# Altium schematic sheet cpu.SchDoc: CENTRAL PROCESSING UNIT
size A3; DocumentNumber: UNCNC.04.00.001
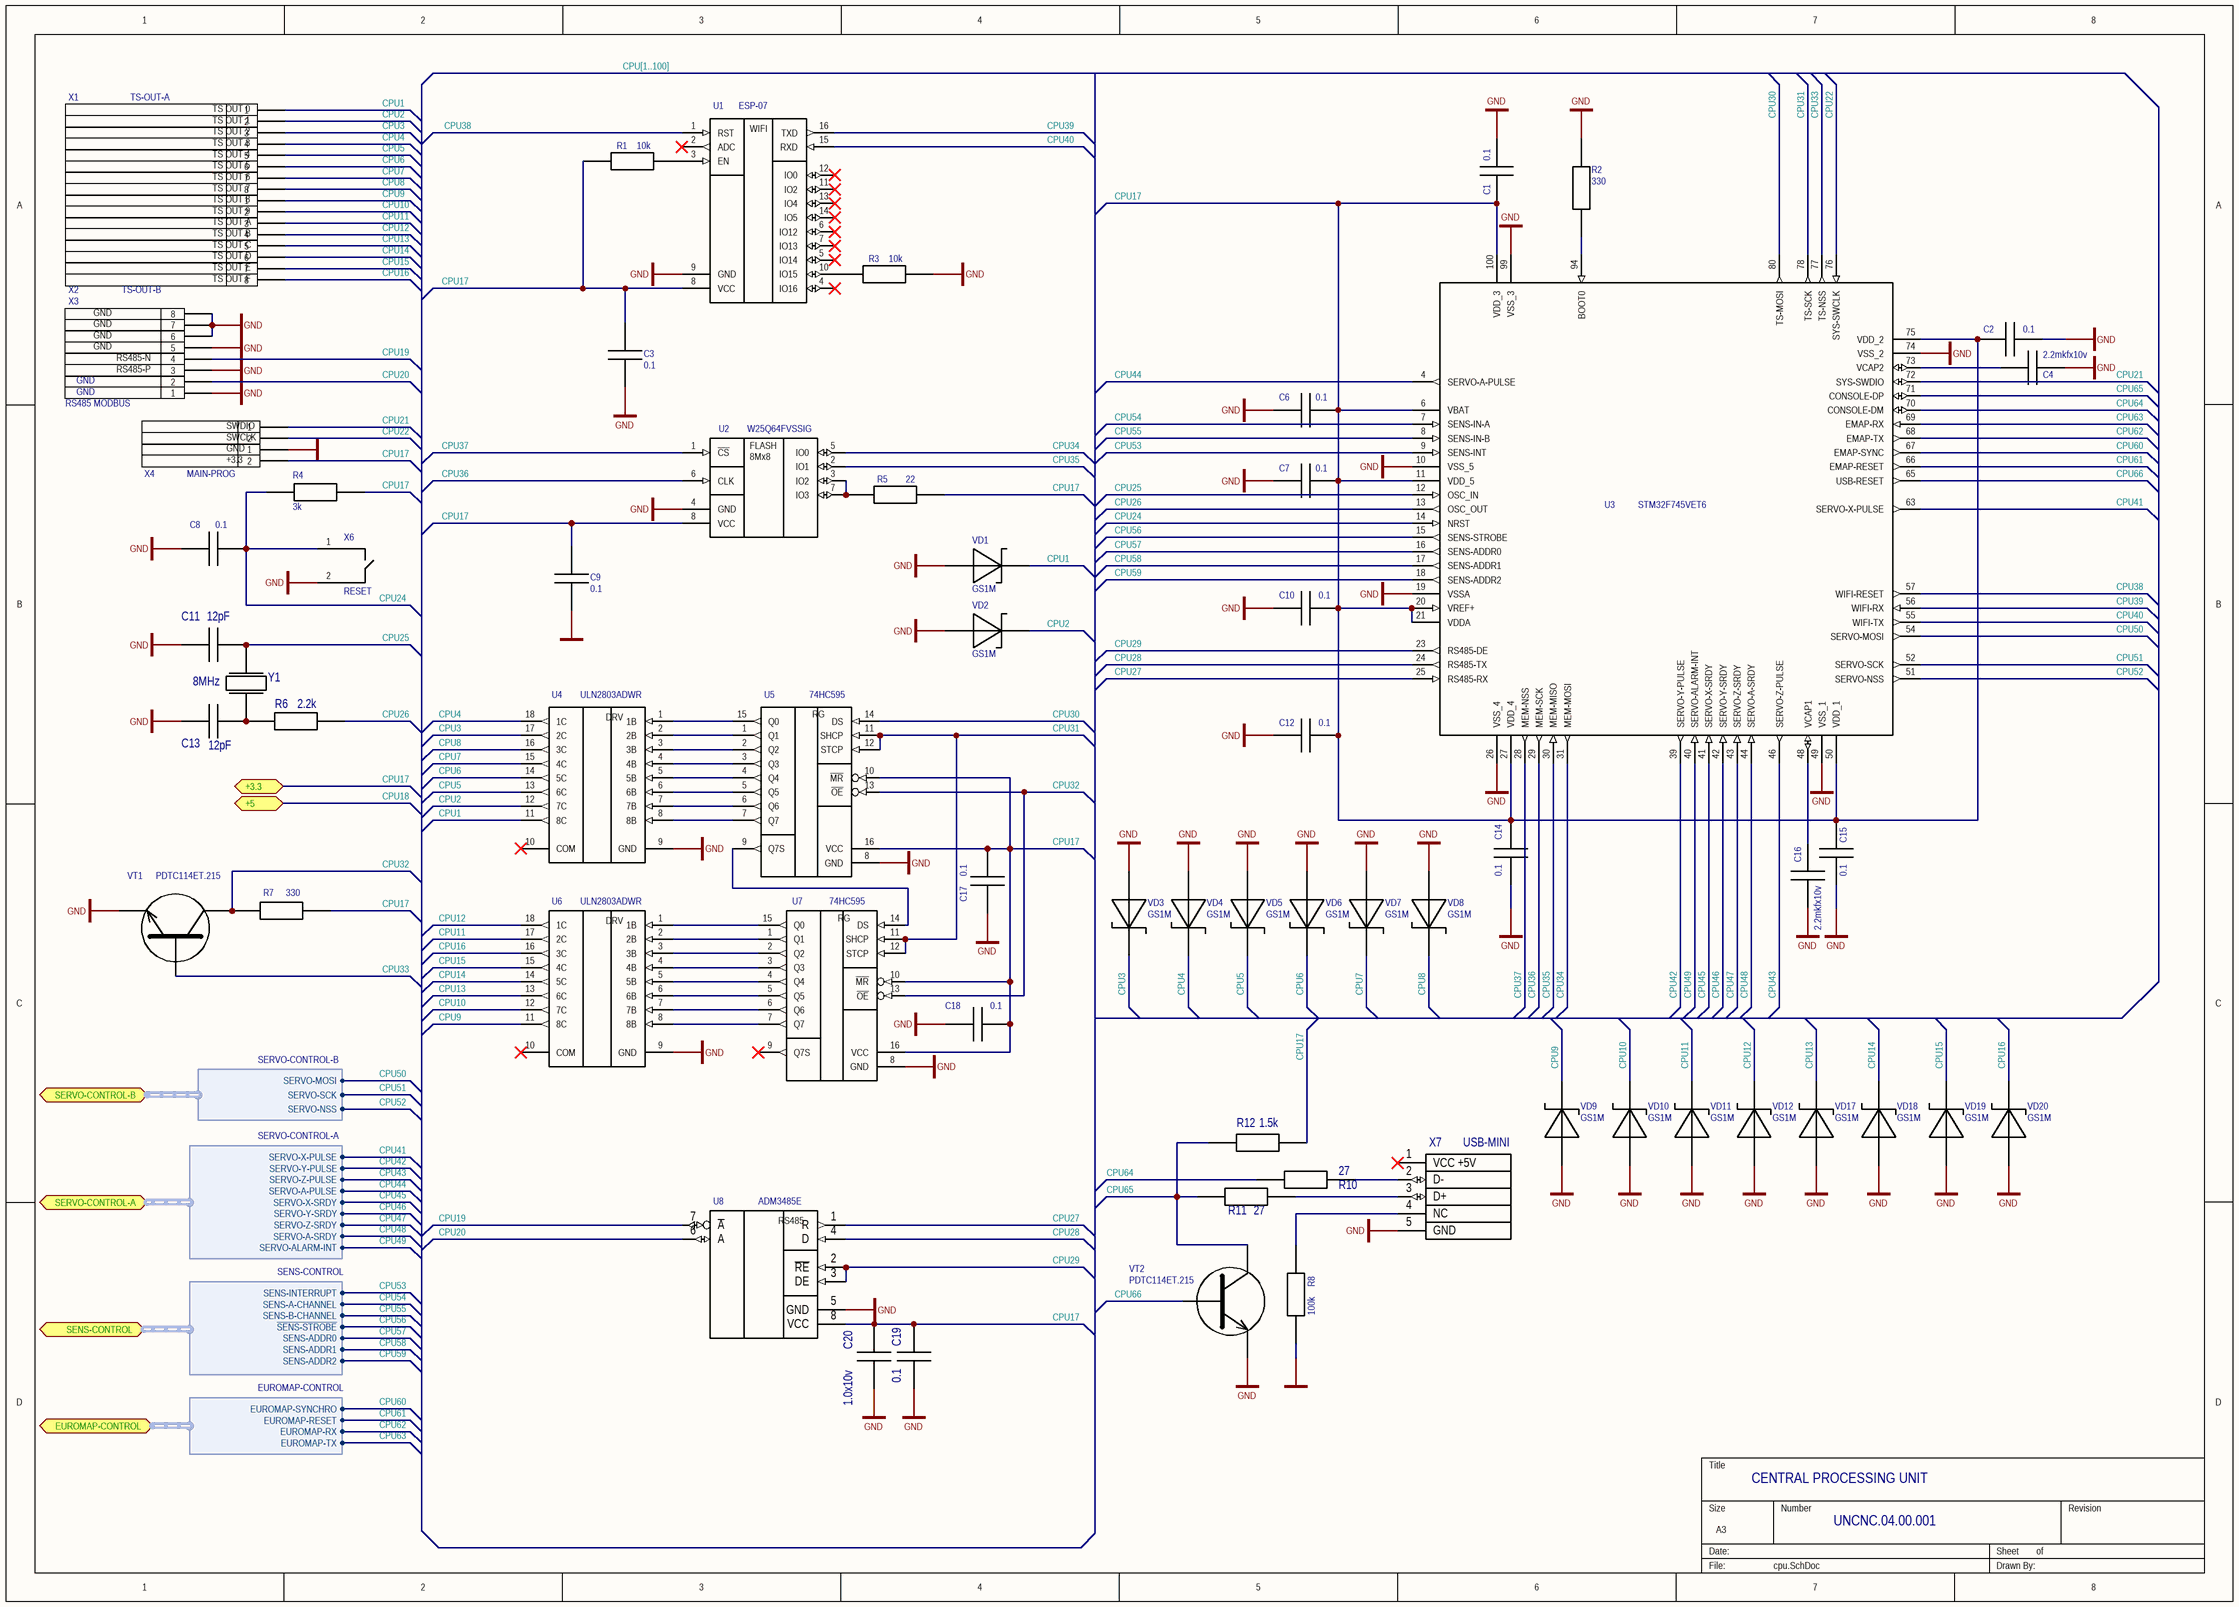
[diagram p0: cpu.SchDoc]

## Parts
C1  0.1  [CAPC1608X05N]
C2  0.1  [CAPC1608X05N]
C3  0.1  [CAPC2012X04N]
C4  2.2mkfx10v  [CAPC1608X05N]
C6  0.1  [CAPC1608X05N]
C7  0.1  [CAPC1608X05N]
C8  0.1  [CAPC1608X05N]
C9  0.1  [CAPC2012X04N]
C10  0.1  [CAPC1608X05N]
C11  12pF  [CAPC1608X05N]
C12  0.1  [CAPC1608X05N]
C13  12pF  [CAPC1608X05N]
C14  0.1  [CAPC1608X05N]
C15  0.1  [CAPC1608X05N]
C16  2.2mkfx10v  [CAPC1608X05N]
C17  0.1  [CAPC2012X04N]
C18  0.1  [CAPC2012X04N]
C19  0.1  [CAPC2012X04N]
C20  1.0x10v  [CAPC2012X04N]
R1  10k  [RESC2012X04N]
R2  330  [RESC1608X05N]
R3  10k  [RESC2012X04N]
R4  3k  [RESC1608X05N]
R5  22  [RESC2012X04N]
R6  2.2k  [RESC1608X05N]
R7  330  [RESC1608X05N]
R8  100k  [RESC2012X04N]
R10  27  [RESC2012X04N]
R11  27  [RESC2012X04N]
R12  1.5k  [RESC2012X04N]
U1  ESP-07  [ESP-07]
U2  W25Q64FVSSIG  [SOIC127P790X203-8N(WIDE)]
U3  STM32F745VET6  [TSQFP50P1600X1600X160-100N]
U4  ULN2803ADWR  [SOIC127P1030X265-18N]
U5  74HC595  [SOP127P700X210-16N]
U6  ULN2803ADWR  [SOIC127P1030X265-18N]
U7  74HC595  [SOP127P700X210-16N]
U8  ADM3485E  [SOIC127P600X175-8N]
VD1  GS1M  [DIOM4336X21N]
VD2  GS1M  [DIOM4336X21N]
VD3  GS1M  [DIOM4336X21N]
VD4  GS1M  [DIOM4336X21N]
VD5  GS1M  [DIOM4336X21N]
VD6  GS1M  [DIOM4336X21N]
VD7  GS1M  [DIOM4336X21N]
VD8  GS1M  [DIOM4336X21N]
VD9  GS1M  [DIOM4336X21N]
VD10  GS1M  [DIOM4336X21N]
VD11  GS1M  [DIOM4336X21N]
VD12  GS1M  [DIOM4336X21N]
VD17  GS1M  [DIOM4336X21N]
VD18  GS1M  [DIOM4336X21N]
VD19  GS1M  [DIOM4336X21N]
VD20  GS1M  [DIOM4336X21N]
VT1  PDTC114ET.215  [SOT95P238X102-3N]
VT2  PDTC114ET.215  [SOT95P238X102-3N]
X1  TS-OUT-A  [MINI-FIT-8-WAY-SM]
X2  TS-OUT-B  [MINI-FIT-8-WAY-SM]
X3  RS485 MODBUS  [RJ45-CAN]
X4  MAIN-PROG  [ZL201-2]
X5  Jamper ZL201  [ZL201-2]  (value not drawn)
X6  RESET  [TACT SWITCH]
X7  USB-MINI  [229-5FB-MINI-USB]
Y1  8MHz  [KX-13]

## Ports
+3.3, +5, EUROMAP-CONTROL (harness EUROMAP-CONTROL), SENS-CONTROL (harness SENS-CONTROL), SERVO-CONTROL-A (harness SERVO-CONTROL-A), SERVO-CONTROL-B (harness SERVO-CONTROL-B)

## Harnesses
SERVO-CONTROL-B: SERVO-MOSI, SERVO-SCK, SERVO-NSS
SERVO-CONTROL-A: SERVO-X-PULSE, SERVO-Y-PULSE, SERVO-Z-PULSE, SERVO-A-PULSE, SERVO-X-SRDY, SERVO-Y-SRDY, SERVO-Z-SRDY, SERVO-A-SRDY, SERVO-ALARM-INT
SENS-CONTROL: SENS-INTERRUPT, SENS-A-CHANNEL, SENS-B-CHANNEL, ~{SENS-STROBE}, SENS-ADDR0, SENS-ADDR1, SENS-ADDR2
EUROMAP-CONTROL: EUROMAP-SYNCHRO, EUROMAP-RESET, EUROMAP-RX, EUROMAP-TX

## Nets
GND: C1.2 C2.1 C3.1 C4.1 C6.2 C7.2 C8.2 C9.1 C10.2 C11.1 C12.2 C13.1 C14.1 C15.1 C16.1 C17.1 C18.1 C19.1 C20.1 R2.2 R3.2 R8.1 U1.9(GND) U2.4(GND) U3.10(VSS_5) U3.19(VSSA) U3.26(VSS_4) U3.49(VSS_1) U3.74(VSS_2) U3.99(VSS_3) U4.9(GND) U5.8(GND) U6.9(GND) U7.8(GND) U8.5(GND) VD1.2(A) VD2.2(A) VD3.2(A) VD4.2(A) VD5.2(A) VD6.2(A) VD7.2(A) VD8.2(A) VD9.2(A) VD10.2(A) VD11.2(A) VD12.2(A) VD17.2(A) VD18.2(A) VD19.2(A) VD20.2(A) VT1.2(E) VT2.2(E) X3.1 X3.3 X3.5 X3.6 X3.7 X3.8 X5.1 X6.2 X7.5(GND)
CPU1: U4.11(8C) VD1.1(C) X1.1
CPU2: U4.12(7C) VD2.1(C) X1.2
CPU3: U4.17(2C) VD3.1(C) X1.3
CPU4: U4.18(1C) VD4.1(C) X1.4
CPU5: U4.13(6C) VD5.1(C) X1.5
CPU6: U4.14(5C) VD6.1(C) X1.6
CPU7: U4.15(4C) VD7.1(C) X1.7
CPU8: U4.16(3C) VD8.1(C) X1.8
CPU9: U6.11(8C) VD9.1(C) X2.1
CPU10: U6.12(7C) VD10.1(C) X2.2
CPU11: U6.17(2C) VD11.1(C) X2.3
CPU12: U6.18(1C) VD12.1(C) X2.4
CPU13: U6.13(6C) VD17.1(C) X2.5
CPU14: U6.14(5C) VD18.1(C) X2.6
CPU15: U6.15(4C) VD19.1(C) X2.7
CPU16: U6.16(3C) VD20.1(C) X2.8
CPU17: C1.1 C2.2 C3.2 C6.1 C7.1 C9.2 C10.1 C12.1 C14.2 C15.2 C17.2 C18.2 C19.2 C20.2 R1.1 R4.1 R5.2 R7.1 R12.2 U1.8(VCC) U2.8(VCC) U3.6(VBAT) U3.11(VDD_5) U3.20(VREF+) U3.21(VDDA) U3.27(VDD_4) U3.50(VDD_1) U3.75(VDD_2) U3.100(VDD_3) U5.10(~{MR}) U5.16(VCC) U7.10(~{MR}) U7.16(VCC) U8.8(VCC) X5.2 ; port +3.3
CPU18: port +5
CPU19: U8.7(~{A}) X3.4
CPU20: U8.6(A) X3.2
CPU21: U3.72(SYS-SWDIO) X4.1
CPU22: U3.76(SYS-SWCLK) X4.2
CPU24: C8.1 R4.2 U3.14(NRST) X6.1
CPU25: C11.2 U3.12(OSC_IN) Y1.2
CPU26: R6.2 U3.13(OSC_OUT)
CPU27: U3.25(RS485-RX) U8.1(R)
CPU28: U3.24(RS485-TX) U8.4(D)
CPU29: U3.23(RS485-DE) U8.2(~{RE}) U8.3(DE)
CPU30: U3.80(TS-MOSI) U5.14(DS)
CPU31: U3.78(TS-SCK) U5.11(SHCP) U5.12(STCP) U7.11(SHCP) U7.12(STCP)
CPU32: R7.2 U5.13(~{OE}) U7.13(~{OE}) VT1.3(C)
CPU33: U3.77(TS-NSS) VT1.1(B)
CPU34: U2.5(IO0) U3.31(MEM-MOSI)
CPU35: U2.2(IO1) U3.30(MEM-MISO)
CPU36: U2.6(CLK) U3.29(MEM-SCK)
CPU37: U2.1(~{CS}) U3.28(MEM-NSS)
CPU38: U1.1(RST) U3.57(WIFI-RESET)
CPU39: U1.16(TXD) U3.56(WIFI-RX)
CPU40: U1.15(RXD) U3.55(WIFI-TX)
CPU41: U3.63(SERVO-X-PULSE) ; port SERVO-CONTROL-A.SERVO-X-PULSE
CPU42: U3.39(SERVO-Y-PULSE) ; port SERVO-CONTROL-A.SERVO-Y-PULSE
CPU43: U3.46(SERVO-Z-PULSE) ; port SERVO-CONTROL-A.SERVO-Z-PULSE
CPU44: U3.4(SERVO-A-PULSE) ; port SERVO-CONTROL-A.SERVO-A-PULSE
CPU45: U3.41(SERVO-X-SRDY) ; port SERVO-CONTROL-A.SERVO-X-SRDY
CPU46: U3.42(SERVO-Y-SRDY) ; port SERVO-CONTROL-A.SERVO-Y-SRDY
CPU47: U3.43(SERVO-Z-SRDY) ; port SERVO-CONTROL-A.SERVO-Z-SRDY
CPU48: U3.44(SERVO-A-SRDY) ; port SERVO-CONTROL-A.SERVO-A-SRDY
CPU49: U3.40(SERVO-ALARM-INT) ; port SERVO-CONTROL-A.SERVO-ALARM-INT
CPU50: U3.54(SERVO-MOSI) ; port SERVO-CONTROL-B.SERVO-MOSI
CPU51: U3.52(SERVO-SCK) ; port SERVO-CONTROL-B.SERVO-SCK
CPU52: U3.51(SERVO-NSS) ; port SERVO-CONTROL-B.SERVO-NSS
CPU53: U3.9(SENS-INT) ; port SENS-CONTROL.SENS-INTERRUPT
CPU54: U3.7(SENS-IN-A) ; port SENS-CONTROL.SENS-A-CHANNEL
CPU55: U3.8(SENS-IN-B) ; port SENS-CONTROL.SENS-B-CHANNEL
CPU56: U3.15(SENS-STROBE) ; port SENS-CONTROL.~{SENS-STROBE}
CPU57: U3.16(SENS-ADDR0) ; port SENS-CONTROL.SENS-ADDR0
CPU58: U3.17(SENS-ADDR1) ; port SENS-CONTROL.SENS-ADDR1
CPU59: U3.18(SENS-ADDR2) ; port SENS-CONTROL.SENS-ADDR2
CPU60: U3.67(EMAP-SYNC) ; port EUROMAP-CONTROL.EUROMAP-SYNCHRO
CPU61: U3.66(EMAP-RESET) ; port EUROMAP-CONTROL.EUROMAP-RESET
CPU62: U3.68(EMAP-TX) ; port EUROMAP-CONTROL.EUROMAP-RX
CPU63: U3.69(EMAP-RX) ; port EUROMAP-CONTROL.EUROMAP-TX
CPU64: R10.1 U3.70(CONSOLE-DM)
CPU65: R11.1 R12.1 U3.71(CONSOLE-DP) VT2.3(C)
CPU66: U3.65(USB-RESET) VT2.1(B)
NetC4_2: C4.2 U3.73(VCAP2)
NetC13_2: C13.2 R6.1 Y1.1
NetC16_2: C16.2 U3.48(VCAP1)
NetR1_2: R1.2 U1.3(EN)
NetR2_1: R2.1 U3.94(BOOT0)
NetR3_1: R3.1 U1.10(IO15)
NetR5_1: R5.1 U2.3(IO2) U2.7(IO3)
NetR8_2: R8.2 X7.4(NC)
NetR10_2: R10.2 X7.2(D-)
NetR11_2: R11.2 X7.3(D+)
NetU4_1: U4.1(1B) U5.15(Q0)
NetU4_2: U4.2(2B) U5.1(Q1)
NetU4_3: U4.3(3B) U5.2(Q2)
NetU4_4: U4.4(4B) U5.3(Q3)
NetU4_5: U4.5(5B) U5.4(Q4)
NetU4_6: U4.6(6B) U5.5(Q5)
NetU4_7: U4.7(7B) U5.6(Q6)
NetU4_8: U4.8(8B) U5.7(Q7)
NetU5_9: U5.9(Q7S) U7.14(DS)
NetU6_1: U6.1(1B) U7.15(Q0)
NetU6_2: U6.2(2B) U7.1(Q1)
NetU6_3: U6.3(3B) U7.2(Q2)
NetU6_4: U6.4(4B) U7.3(Q3)
NetU6_5: U6.5(5B) U7.4(Q4)
NetU6_6: U6.6(6B) U7.5(Q5)
NetU6_7: U6.7(7B) U7.6(Q6)
NetU6_8: U6.8(8B) U7.7(Q7)

Not connected (* = marked no-connect by the designer): U1 2(ADC)* 4(IO16)* 5(IO14)* 6(IO12)* 7(IO13)* 11(IO2)* 12(IO0)* 13(IO4)* 14(IO5)*; U3 1(PE2) 2(PE3) 3(PE4) 5(PE6) 22(PA0-WKUP) 32(PC4) 33(PC5) 34(PB0) 35(PB1) 36(PB2) 37(PE7) 38(PE8) 45(PE15) 47(PB11) 53(PB14) 58(PD11) 59(PD12) 60(PD13) 61(PD14) 62(PD15) 64(PC7) 79(PC11) 81(PD0) 82(PD1) 83(PD2) 84(PD3) 85(PD4) 86(PD5) 87(PD6) 88(PD7) 89(PB3) 90(PB4) 91(PB5) 92(PB6) 93(PB7) 95(PB8) 96(PB9) 97(PE0) 98(PE1); U4 10(COM)*; U6 10(COM)*; U7 9(Q7S)*; X7 1(VCC_+5V)*

## Buses and harness runs
bus CPU[1..100]

## Notes on the sheet
- (near X1) TS OUT 0
- (near X1) TS OUT 1
- (near X1) TS OUT 2
- TS OUT 3
- TS OUT 4
- TS OUT 5
- TS OUT 6
- TS OUT 7
- TS OUT 8
- TS OUT 9
- TS OUT A
- TS OUT B
- TS OUT C
- TS OUT D
- GND
- TS OUT E
- TS OUT F
- RS485-N
- RS485-P
- SWDIO
- SWCLK
- +3.3
- (in symbol 74HC595) RG
- (in symbol ESP-07 Wi-Fi module) WIFI
- (in symbol SN65176BD) RS485
- (in symbol ULN2803ADWR) DRV
- (in symbol W25Q64FVSSIG) FLASH; 8Mx8

## Library data of the parts
C1-C4 C6-C20 = C: SMD конденсатор; Ref: http://www.kosmodrom.com.ua/prodlist.php?name=cap1206
R1-R8 R10-R12 = R: SMD резистор; Ref: http://www.kosmodrom.com.ua/prodlist.php?name=res1206
U1 = ESP-07 Wi-Fi module: WIFI модуль; Ref: http://www.kosmodrom.com.ua/el.php?name=ESP8266-ESP-07
U2 = W25Q64FVSSIG: FLASH 8Mx8
U3 = STM32F745VET6: ARM7 microcontroller
U4 U6 = ULN2803ADWR: 8 Darlington transistors
U8 = SN65176BD: RS-485 line driver; Ref: http://www.kosmodrom.com.ua/prodlist.php?page=0&name=SN65176BD&okbutton=%CF%EE%E8%F1%EA+%EF%EE+%F1%EA%EB%E0%E4%F3
VD1-VD12 VD17-VD20 = SS26: диод Шоттки
VT1 VT2 = PDTC114ET.215: NPN transistor with bias circuit
X1 X2 = MINI-FIT-8-WAY-M
X3 = RJ45-CAN: CAN-Bus connector; Ref: http://www.kosmodrom.com.ua/el.php?name=TJ9S-8P8C
X4 = Jamper ZL201
X6 = TACT SWITCH
X7 = USB-MINI: Разъем USB-B розетка; Ref: http://www.kosmodrom.com.ua/el.php?name=229-5FB
Y1 = CERAMIC-RESONATOR: Кварцевый резонатор; Ref( 8MHz): http://www.kosmodrom.com.ua/el.php?name=KX-13-8.0-MHz; Ref (6MHz): http://www.kosmodrom.com.ua/el.php?name=KX-13%206.0%20MHz